# EAGLE design led_control (EAGLE 5.11)
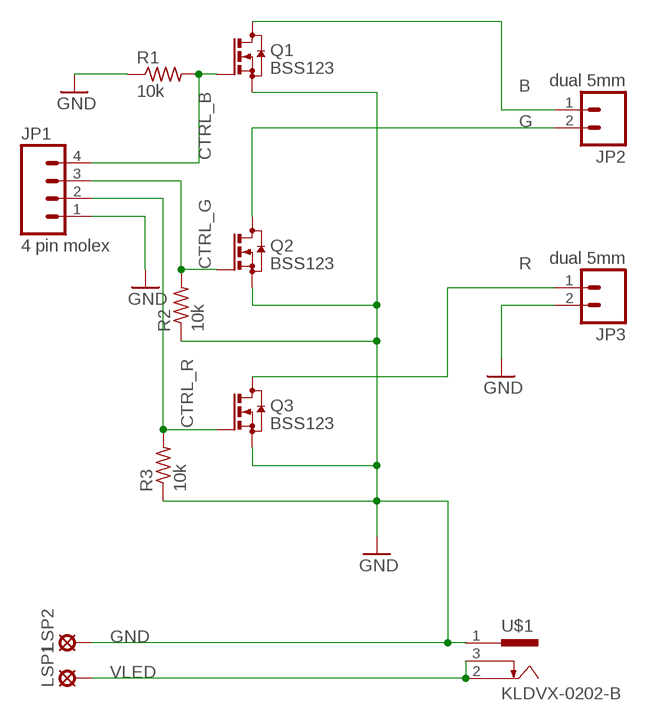
[diagram p0: schematic, sheet 1]

## Parts
JP1  4 pin molex  M04PTH  [1X04]
JP2  dual 5mm  M025MM  [SCREWTERMINAL-5MM-2]
JP3  dual 5mm  M025MM  [SCREWTERMINAL-5MM-2]
LSP1  SE14  [SE14]
LSP2  SE14  [SE14]
Q1  BSS123  [SOT23]
Q2  BSS123  [SOT23]
Q3  BSS123  [SOT23]
R1  10k  R-US_0309/12  [0309/12]
R2  10k  R-US_0309/12  [0309/12]
R3  10k  R-US_0309/12  [0309/12]
U$1  KLDVX-0202-B  [KLDVX-0202-B]

## Nets
B: JP2.1 Q1.3(D)
CTRL_B: JP1.4 Q1.1(G) R1.2
CTRL_G: JP1.3 Q2.1(G) R2.2
CTRL_R: JP1.2 Q3.1(G) R3.2
G: JP2.2 Q2.3(D)
GND: JP1.1 JP3.2 LSP2.MP Q1.2(S) Q2.2(S) Q3.2(S) R1.1 R2.1 R3.1 U$1.1
R: JP3.1 Q3.3(D)
VLED: LSP1.MP U$1.2 U$1.3
Unconnected: U$1.1@1 U$1.2@1 U$1.3@1

## Library data of the parts
JP1 = SparkFun:M04: Header 4 Standard 4-pin 0.1" header. Use with straight break away headers (SKU : PRT-00116), right angle break away headers (PRT-00553), swiss pins (PRT-00743), machine pins (PRT-00117), and female headers (PRT-00115). Molex polarized connector foot print use with SKU : PRT-08231 with associated crimp pins and housings. 1MM SMD Version SKU: PRT-10208
JP2 JP3 = SparkFun:M02: Header 2 Standard 2-pin 0.1" header. Use with straight break away headers (SKU : PRT-00116), right angle break away headers (PRT-00553), swiss pins (PRT-00743), machine pins (PRT-00117), and female headers (PRT-00115). Molex polarized connector foot print use with SKU : PRT-08233 with associated crimp pins and housings.
LSP1 LSP2 = solpad:SE14: SOLDER PAD E1553, drill 1,4mm, distributor Buerklin, 07F820
Q1-Q3 = transistor-small-signal:BSS123: N-CHANNEL MOS FET
R1-R3 = rcl:R-US_: RESISTOR, American symbol
U$1 = con-kycon:KLDVX-0202-: Power Jack, Vertical, PCB Mount, 2.0 mm, 2.5 mm, 3.0 mm Center Pin Source: KLDVX-0202x.pdf; OC_FARNELL: unknown; OC_NEWARK: unknown

## Net classes
0 default: width 1.016 mm, clearance 0.254 mm

## Board
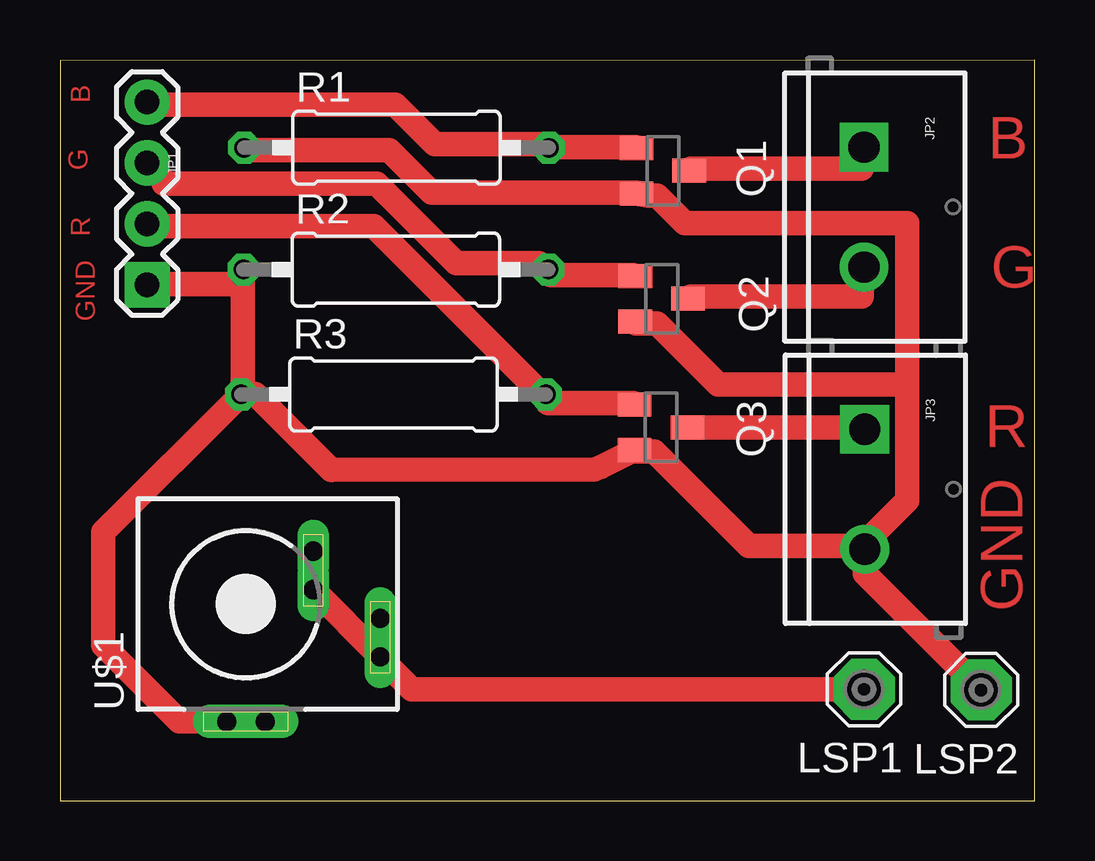
[diagram p1: board, top side]

Size 40.62 x 30.89 mm. Coordinates in mm from the lower left corner, seen from the top.
Outline: 0,0 40.62,0 40.62,30.89 0,30.86 0,0
Copper layers (1*16): Top 0.035mm / dielectric 1.5mm / Bottom 0.035mm
Design rules "default": minimum track width 10mil, minimum drill 24mil, track to track 8mil, track to pad 8mil, pad to pad 8mil, via to via 8mil, smd to smd 8mil, copper to edge 40mil, drill to drill 8mil, minimum pad ring 10mil, minimum via ring 8mil, stop-mask expansion 4mil, vias tented up to drill 0mil, thermal gap 10mil

### Footprints (pad centres in the part's own frame; a part is rotated, then mirrored left to right if it is on the bottom)
1X04 = drill 1.016 pad 1.88 square: 1 0,0 | drill 1.016 pad 1.88 round: 2 2.54,0; 3 5.08,0; 4 7.62,0
SCREWTERMINAL-5MM-2 = drill 1.3 pad 2.032 square: 1 0,0 | drill 1.3 pad 2.032 round: 2 5,0
SE14 = drill 1.397 pad 2.54 octagon: MP 0,0
SOT23 = smd 1 x 1.4: 1 -0.95,-1.1; 2 0.95,-1.1; 3 0,1.1
0309/12 = drill 0.813 octagon: 1 -6.35,0; 2 6.35,0
KLDVX-0202-B = drill 0.8 pad 1.4 long: 1 -4.9,0.8; 1@1 -4.9,-0.8 | drill 0.8 pad 1.3 long: 2 -2.2,-5.6; 2@1 -0.6,-5.6; 3 0.6,-2.8; 3@1 2.2,-2.8

### Placement (x,y rotation side)
JP1  3.63,21.51 90 top
JP2  33.5,27.25 270 top
JP3  33.53,15.49 270 top
LSP1  33.5,4.65 0 top
LSP2  38.38,4.62 0 top
Q1  25.12,26.26 270 top
Q2  25.07,20.93 270 top
Q3  25.04,15.57 270 top
R1  14.02,27.23 0 top
R2  14,22.15 0 top
R3  13.89,16.94 0 top
U$1  7.75,8.2 90 top

### Tracks (layer width: path | path; a pad name or v marks a point on that pad's centre or on a via)
B
  Top 1.016: Q1.3 26.29,26.37 33.4,26.37 33.4,27.25 JP2.1
CTRL_B
  Top 1.016: Q1.1 24,27.25 20.45,27.25 R1.2 19.94,27.38 15.62,27.38 13.97,29.03 3.68,29.03 JP1.4
CTRL_G
  Top 1.016: Q2.1 23.88,21.92 20.45,21.92 20.45,22.05 R2.2 19.94,22.43 16.51,22.43 13.21,25.73 4.32,25.73 4.32,25.86 3.68,26.49 JP1.3
CTRL_R
  Top 1.016: Q3.1 23.88,16.59 20.32,16.59 20.32,16.84 R3.2 19.81,17.22 13.08,23.95 3.68,23.95 JP1.2
G
  Top 1.016: Q2.3 26.29,21.03 33.4,21.03 33.4,22.17 JP2.2
GND
  Top 1.016: R1.1 7.75,27.13 13.72,27.13 15.49,25.35 24,25.35 Q1.2 24.51,25.22 24.89,25.22 26.03,24.08 35.31,24.08 35.31,17.35 | 7.62,21.54 7.62,22.05 R2.1 | 7.62,21.54 7.62,16.97 R3.1 | JP1.1 3.68,21.54 7.62,21.54 | JP3.2 33.53,10.62 28.7,10.62 24.77,14.55 24,14.55 Q3.2 22.53,13.92 22.25,13.82 11.3,13.79 8.13,16.97 R3.1 | 35.31,17.35 27.43,17.35 24.89,19.89 24,19.89 Q2.2 | 35.31,17.35 35.31,12.52 33.78,11 JP3.2 | LSP2.MP 33.53,9.47 JP3.2 | U$1.1 4.98,3.3 1.8,6.48 1.8,11.2 R3.1
R
  Top 1.016: Q3.3 33.53,15.57 JP3.1
VLED
  Top 0.406: U$1.2 13.35,5.96
  Top 1.016: U$1.2 U$1.3 | 13.35,5.96 14.66,4.65 LSP1.MP

### Text on the board
Top: B | G | B | R | G | GND | R | GND